# Altium schematic sheet EXTERNAL_FAN.SchDoc
size A; SheetNumber: 9; SheetTotal: 21
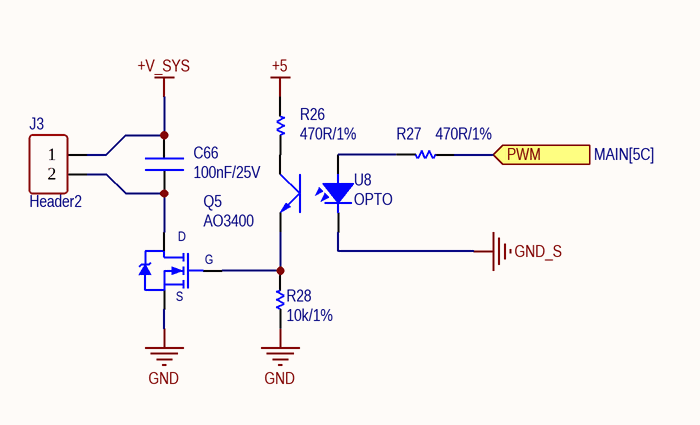
[diagram p0: EXTERNAL_FAN.SchDoc]

## Parts
C66  100nF/25V  [CN-SMD-0603]
J3  Header2  [XH2.54-2-DIP]
Q5  AO3400  [SOT23-123]
R26  470R/1%  [RES-SMD-0603]
R27  470R/1%  [RES-SMD-0603]
R28  10k/1%  [RES-SMD-0603]
U8  OPTO  [EL3H7]

## Ports
PWM (in, see MAIN[5C])

## Nets
+5: R26.1
+V_SYS: C66.1 J3.1
GND: Q5.3(S) R28.1
GND_S: U8.K
PWM: R27.1 ; port PWM
NetC66_2: C66.2 J3.2 Q5.2(D)
NetQ5_1: Q5.1(G) R28.2 U8.E
NetR26_2: R26.2 U8.C
NetR27_2: R27.2 U8.A

## Library data of the parts
C66 = CN: CL10B104KA8NNNC; PN: CL10B104KA8NNNC
J3 = Header2: Connector 2; Manufacturer: W¨¹rth Elektronik eiSos GmbH; partNo: 613002143121; ComponentLink1 Description: Manufacturer; ComponentLink2 Description: Datasheet; NoPins: 02; Created Date: 29 March 2013; ComponentLink1URL: http://www.we-online.com; ComponentLink2URL: http://katalog.we-online.de/em/datasheet/6130xx143121.pdf; Created by: Karrer Zheng
Q5 = AO3400: N-MOS 30V 5.8A; PN: AO3400
R26 R27 = Res-SMD: ERJ-1GJF4700C; Manufacturer: Generic Components; Class: Passive; PN: ERJ-1GJF4700C; Publisher: Altium Hobart Technology Centre
R28 = Res-SMD: ERJ-3EKF1002V; Manufacturer: Generic Components; Class: Passive; PN: ERJ-3EKF1002V; Publisher: Altium Hobart Technology Centre
U8 = OPTO: EL3H7(B)(TA)-VG; PN: EL3H7(B)(TA)-VG